# EAGLE schematic Driver (EAGLE 9.6.2)
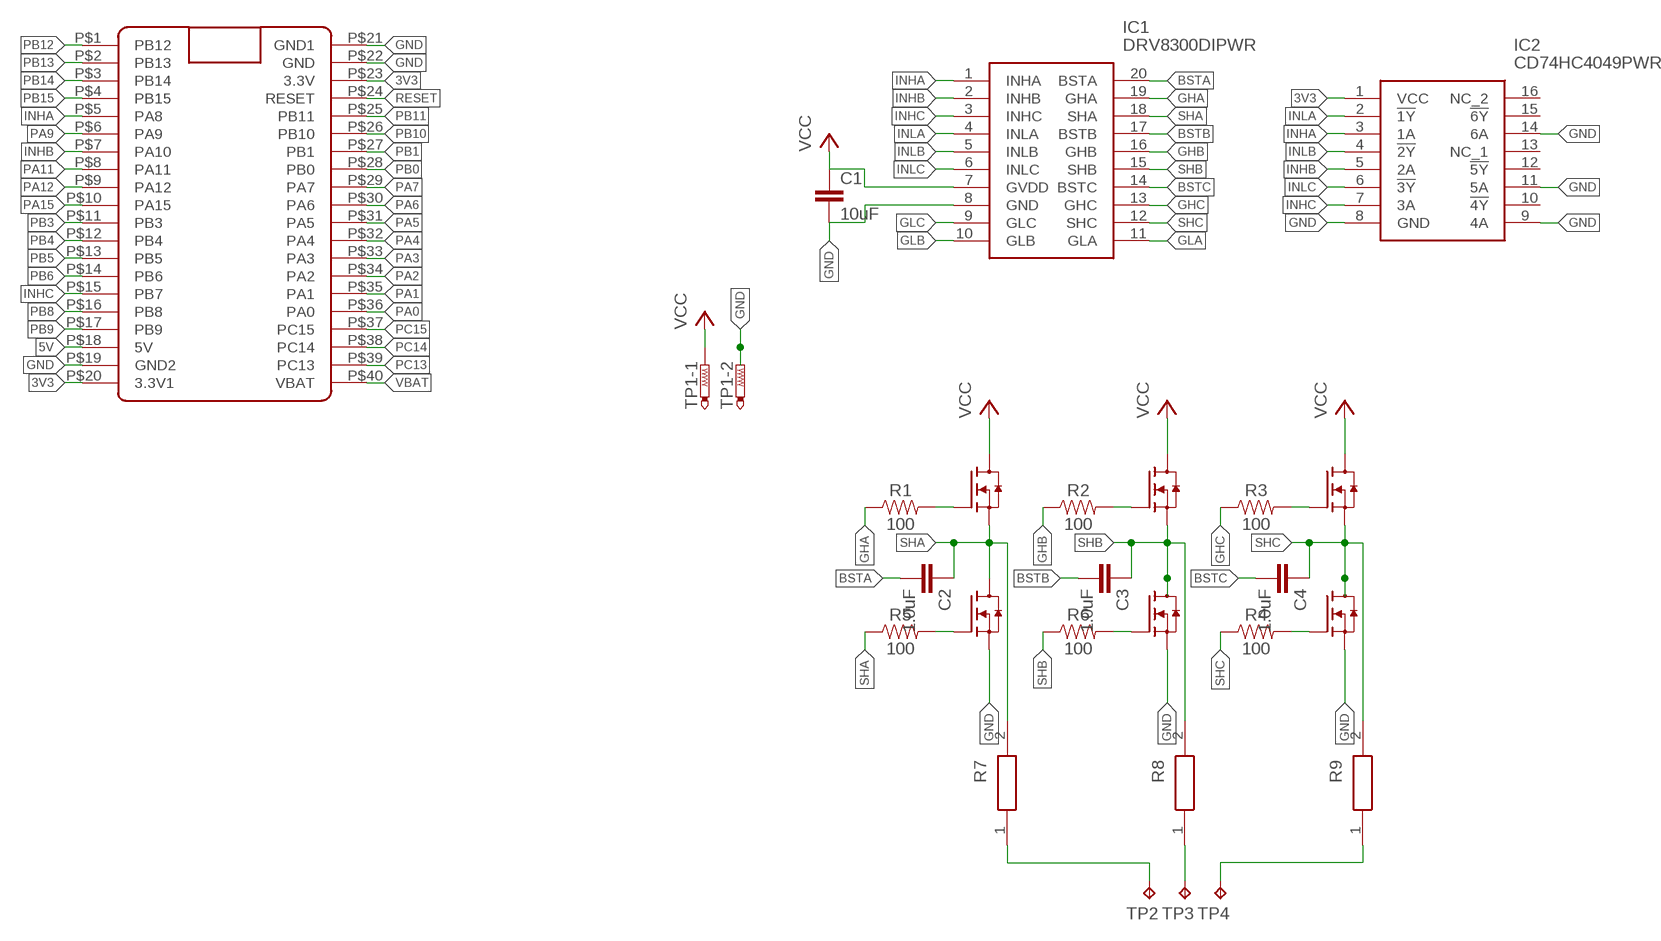
[diagram p0: schematic, sheet 1]

## Parts
C1  10uF  10UF-0603-6.3V-20%  [0603]
C2  1.0uF  1.0UF-0603-16V-10%  [0603]
C3  1.0uF  1.0UF-0603-16V-10%  [0603]
C4  1.0uF  1.0UF-0603-16V-10%  [0603]
IC1  DRV8300DIPWR  [SOP65P640X120-20N]
IC2  CD74HC4049PWR  [SOP65P640X120-16N]
R1  100  100OHM-0603-1/10W-1%  [0603]
R2  100  100OHM-0603-1/10W-1%  [0603]
R3  100  100OHM-0603-1/10W-1%  [0603]
R4  100  100OHM-0603-1/10W-1%  [0603]
R5  100  100OHM-0603-1/10W-1%  [0603]
R6  100  100OHM-0603-1/10W-1%  [0603]
R7  CR2512-FX-51R1ELF  [RESC6331X75N]
R8  CR2512-FX-51R1ELF  [RESC6331X75N]
R9  CR2512-FX-51R1ELF  [RESC6331X75N]
TP1  PTR2  [P2-38-17]
TP2  TPTP20SQ  [TP20SQ]
TP3  TPTP20SQ  [TP20SQ]
TP4  TPTP20SQ  [TP20SQ]
U$1  BLUE_PILL  [BLUE_PILL]
U$2  IRLR7843  [TO252]
U$3  IRLR7843  [TO252]
U$4  IRLR7843  [TO252]
U$5  IRLR7843  [TO252]
U$6  IRLR7843  [TO252]
U$7  IRLR7843  [TO252]

## Nets
3V3: IC2.1(VCC) U$1.P$20(3.3V1) U$1.P$23(3.3V)
5V: U$1.P$18(5V)
BSTA: C2.2 IC1.20(BSTA)
BSTB: C3.2 IC1.17(BSTB)
BSTC: C4.2 IC1.14(BSTC)
GHA: IC1.19(GHA) R1.1
GHB: IC1.16(GHB) R2.1
GHC: IC1.13(GHC) R3.1
GLA: IC1.11(GLA)
GLB: IC1.10(GLB)
GLC: IC1.9(GLC)
GND: C1.2 IC1.8(GND) IC2.8(GND) IC2.9(4A) IC2.11(5A) IC2.14(6A) TP1.TP-2 U$1.P$19(GND2) U$1.P$21(GND1) U$1.P$22(GND) U$3.2(S) U$5.2(S) U$7.2(S)
INHA: IC1.1(INHA) IC2.3(1A) U$1.P$5(PA8)
INHB: IC1.2(INHB) IC2.5(2A) U$1.P$7(PA10)
INHC: IC1.3(INHC) IC2.7(3A) U$1.P$15(PB7)
INLA: IC1.4(INLA) IC2.2(!1Y)
INLB: IC1.5(INLB) IC2.4(!2Y)
INLC: IC1.6(INLC) IC2.6(!3Y)
N$1: R1.2 U$2.1(G)
N$2: R2.2 U$4.1(G)
N$3: R3.2 U$6.1(G)
N$4: R5.2 U$3.1(G)
N$5: R6.2 U$5.1(G)
N$6: R4.2 U$7.1(G)
N$7: R7.1 TP2.TP
N$8: R8.1 TP3.TP
N$9: R9.1 TP4.TP
PA0: U$1.P$36(PA0)
PA1: U$1.P$35(PA1)
PA2: U$1.P$34(PA2)
PA3: U$1.P$33(PA3)
PA4: U$1.P$32(PA4)
PA5: U$1.P$31(PA5)
PA6: U$1.P$30(PA6)
PA7: U$1.P$29(PA7)
PA9: U$1.P$6(PA9)
PA11: U$1.P$8(PA11)
PA12: U$1.P$9(PA12)
PA15: U$1.P$10(PA15)
PB0: U$1.P$28(PB0)
PB1: U$1.P$27(PB1)
PB3: U$1.P$11(PB3)
PB4: U$1.P$12(PB4)
PB5: U$1.P$13(PB5)
PB6: U$1.P$14(PB6)
PB8: U$1.P$16(PB8)
PB9: U$1.P$17(PB9)
PB10: U$1.P$26(PB10)
PB11: U$1.P$25(PB11)
PB12: U$1.P$1(PB12)
PB13: U$1.P$2(PB13)
PB14: U$1.P$3(PB14)
PB15: U$1.P$4(PB15)
PC13: U$1.P$39(PC13)
PC14: U$1.P$38(PC14)
PC15: U$1.P$37(PC15)
RESET: U$1.P$24(RESET)
SHA: C2.1 IC1.18(SHA) R5.1 R7.2 U$2.2(S) U$3.3(D)
SHB: C3.1 IC1.15(SHB) R6.1 R8.2 U$4.2(S) U$5.3(D)
SHC: C4.1 IC1.12(SHC) R4.1 R9.2 U$6.2(S) U$7.3(D)
VBAT: U$1.P$40(VBAT)
VCC: C1.1 IC1.7(GVDD) TP1.TP-1 U$2.3(D) U$4.3(D) U$6.3(D)
Unconnected: IC2.10(!4Y) IC2.12(!5Y) IC2.13(NC_1) IC2.15(!6Y) IC2.16(NC_2)

## Library data of the parts
C1 = SparkFun-Capacitors:10UF: 10.0µF ceramic capacitors A capacitor is a passive two-terminal electrical component used to store electrical energy temporarily in an electric field.; PROD_ID: CAP-11015
C2-C4 = SparkFun-Capacitors:1.0UF: 1µF ceramic capacitors A capacitor is a passive two-terminal electrical component used to store electrical energy temporarily in an electric field.; PROD_ID: CAP-00868
IC1 = DRV8300DIPWR:DRV8300DIPWR: DRV8300DIPWR Source: Datasheet <https://www.ti.com/lit/gpn/drv8300?HQS=ti-null-null-sf-df-pf-sep-wwe&DCM=yes>; ARROW_PART_NUMBER: DRV8300DIPWR; ARROW_PRICE-STOCK: https://www.arrow.com/en/products/drv8300dipwr/texas-instruments?region=nac; DESCRIPTION: DRV8300DIPWR; HEIGHT: 1.2mm; MANUFACTURER_NAME: Texas Instruments; MANUFACTURER_PART_NUMBER: DRV8300DIPWR; MOUSER_PART_NUMBER: 595-DRV8300DIPWR; MOUSER_PRICE-STOCK: https://www.mouser.co.uk/ProductDetail/Texas-Instruments/DRV8300DIPWR?qs=CiayqK2gdcI4er0Qz5HSWg%3D%3D
IC2 = CD74HC4049PWR:CD74HC4049PWR: High Speed CMOS Logic Hex Inverting Buffers Source: Datasheet <http://www.ti.com/lit/gpn/cd74hc4049>; ARROW_PART_NUMBER: CD74HC4049PWR; ARROW_PRICE-STOCK: https://www.arrow.com/en/products/cd74hc4049pwr/texas-instruments; DESCRIPTION: High Speed CMOS Logic Hex Inverting Buffers; HEIGHT: 1.2mm; MANUFACTURER_NAME: Texas Instruments; MANUFACTURER_PART_NUMBER: CD74HC4049PWR; MOUSER_PART_NUMBER: 595-CD74HC4049PWR; MOUSER_PRICE-STOCK: https://www.mouser.com/Search/Refine.aspx?Keyword=595-CD74HC4049PWR
R1-R6 = SparkFun-Resistors:100OHM: 100Ω resistor A resistor is a passive two-terminal electrical component that implements electrical resistance as a circuit element. Resistors act to reduce current flow, and, at the same time, act to lower voltage levels within circuits. - Wikipedia; PROD_ID: RES-07863
R7-R9 = CR2512-FX-51R1ELF:CR2512-FX-51R1ELF: BOURNS - CR2512-FX-51R1ELF - RES 2512 51R1 1% 1W TC100 28X7511 Source: Datasheet <http://componentsearchengine.com/Datasheets/2/CR2512-FX-51R1ELF.pdf>; ARROW_PART_NUMBER: CR2512-FX-51R1ELF; ARROW_PRICE-STOCK: https://www.arrow.com/en/products/cr2512-fx-51r1elf/bourns; DESCRIPTION: BOURNS - CR2512-FX-51R1ELF - RES 2512 51R1 1% 1W TC100 28X7511; HEIGHT: 0.75mm; MANUFACTURER_NAME: Bourns; MANUFACTURER_PART_NUMBER: CR2512-FX-51R1ELF; MOUSER_PART_NUMBER: 652-CR2512FX51R1ELF; MOUSER_PRICE-STOCK: https://www.mouser.com/Search/Refine.aspx?Keyword=652-CR2512FX51R1ELF
TP1 = testpad:PTR2: TEST PIN
TP2-TP4 = testpad:TP: Test pad
U$1 = BluePill:BLUE_PILL
U$2-U$7 = BLDC project:IRLR7843